# EAGLE design FeetHEizer - Copy (EAGLE 7.1.0)
the FeetHeizer Project Schematics for the main control board. Uses BLE 4.0 module to communicate with a smartphone user interface. It then controls the two MOSFETS to regulate power going to the heating elements in the shoes.
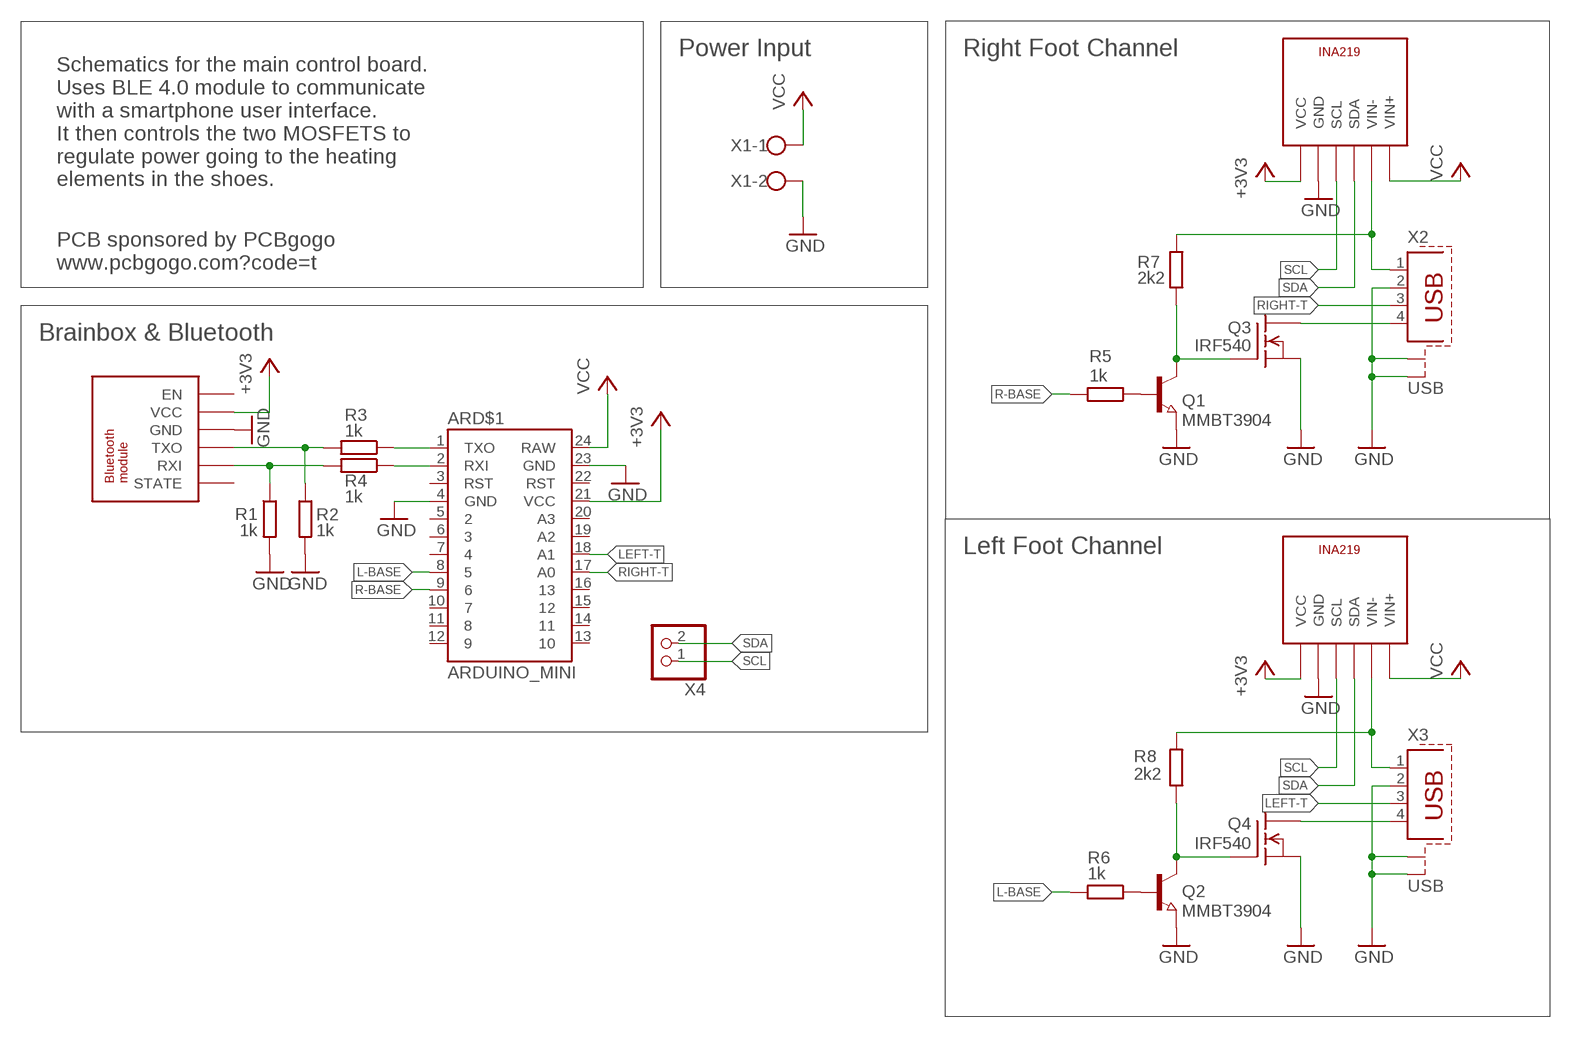
[diagram p0: schematic, sheet 1]

## Parts
ARD$1  ARDUINO_MINI  [ARDUINO_MINI]
MODULE1  BT  [HC10]
MODULE2  INA  [INA]
MODULE3  INA  [INA]
Q1  MMBT3904  NPN-TRANSISTOR_SOT23  [SOT23]
Q2  MMBT3904  NPN-TRANSISTOR_SOT23  [SOT23]
Q3  IRF540  [TO220]
Q4  IRF540  [TO220]
R1  1k  R-EU_R0805  [R0805]
R2  1k  R-EU_R0805  [R0805]
R3  1k  R-EU_R0805  [R0805]
R4  1k  R-EU_R0805  [R0805]
R5  1k  R-EU_R0805  [R0805]
R6  1k  R-EU_R0805  [R0805]
R7  2k2  R-EU_R0805  [R0805]
R8  2k2  R-EU_R0805  [R0805]
X1  W237-102  [W237-102]
X2  USB  [PN87520-S]
X3  USB  [PN87520-S]
X4  PINHD-1X2_2.54  [1X02]

## Nets
+3V3: ARD$1.21(VCC) MODULE1.VCC MODULE2.VCC MODULE3.VCC
GND: ARD$1.4(GND) ARD$1.23(GND) MODULE1.GND MODULE2.GND MODULE3.GND Q1.2(E) Q2.2(E) Q3.3(S) Q4.3(S) R1.2 R2.2 X1.2 X2.2 X2.S1 X2.S2 X3.2 X3.S1 X3.S2
L-BASE: ARD$1.8 R6.2
LEFT-T: ARD$1.18(A1) X3.3
N$1: Q1.3(C) Q3.1(G) R7.1
N$2: Q3.2(D) X2.4
N$3: Q1.1(B) R5.1
N$4: Q2.3(C) Q4.1(G) R8.1
N$5: Q2.1(B) R6.1
N$6: Q4.2(D) X3.4
N$7: MODULE1.RXD(RXI) R1.1 R4.2
N$8: ARD$1.1(TXO) R3.1
N$9: MODULE1.TXD(TXO) R2.1 R3.2
N$10: ARD$1.2(RXI) R4.1
N$11: MODULE2.VIN- R7.2 X2.1
N$12: MODULE3.VIN- R8.2 X3.1
R-BASE: ARD$1.9 R5.2
RIGHT-T: ARD$1.17(A0) X2.3
SCL: MODULE2.SCL MODULE3.SCL X4.1
SDA: MODULE2.SDA MODULE3.SDA X4.2
VCC: ARD$1.24(RAW) MODULE2.VIN+ MODULE3.VIN+ X1.1
Unconnected: ARD$1.3(RST) ARD$1.5 ARD$1.6 ARD$1.7 ARD$1.10 ARD$1.11 ARD$1.12 ARD$1.13 ARD$1.14 ARD$1.15 ARD$1.16 ARD$1.19(A2) ARD$1.20(A3) ARD$1.22(RST) MODULE1.EN MODULE1.STATE

## Notes on the sheet
- Schematics for the main control board.
  Uses BLE 4.0 module to communicate
  with a smartphone user interface.
  It then controls the two MOSFETS to
  regulate power going to the heating
  elements in the shoes.
- Power Input | Right Foot Channel
- PCB sponsored by PCBgogo
  www.pcbgogo.com?code=t
- Brainbox & Bluetooth
- Left Foot Channel

## Library data of the parts
ARD$1 = SparkFun-Boards:ARDUINO_MINI: Arduino Pro Mini footprint
MODULE1 = EEPsModules:BT: HM-10 BLE 4.0 Bluetooth Low Energy Module
MODULE2 MODULE3 = EEPsModules:INA: INA219 Current sensor
Q1 Q2 = semicon-smd-ipc:NPN-TRANSISTOR_: NPN TRANSISTOR
Q3 Q4 = transistor-fet:IRF540: N-Channel Enhancement MOSFET (HEXFET); 100V; 28A; 0,077Ohm
R1-R8 = rcl:R-EU_: RESISTOR, European symbol
X1 = con-wago-500:W237-102: WAGO SCREW CLAMP; MPN: 237-102; OC_FARNELL: unknown; OC_NEWARK: 70K9898
X2 X3 = con-berg-modified:USB
X4 = pinhead-1:PINHD-1X2: PIN HEADER

## Board
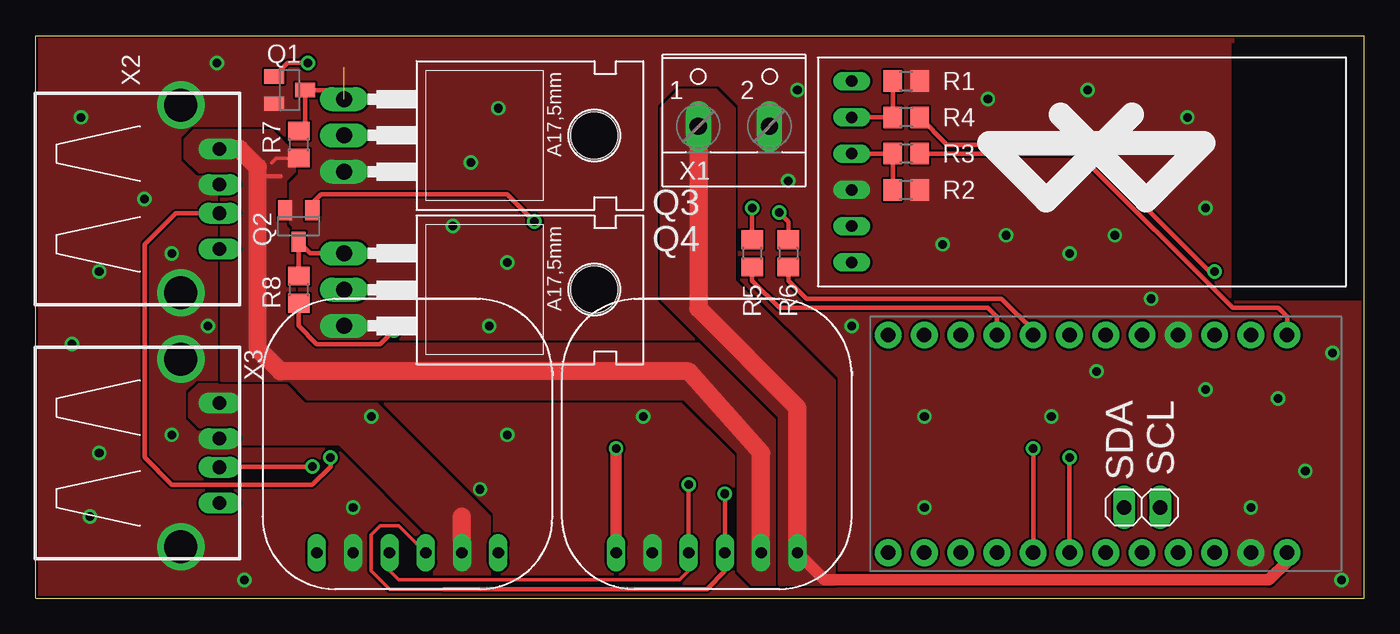
[diagram p1: board, top side]
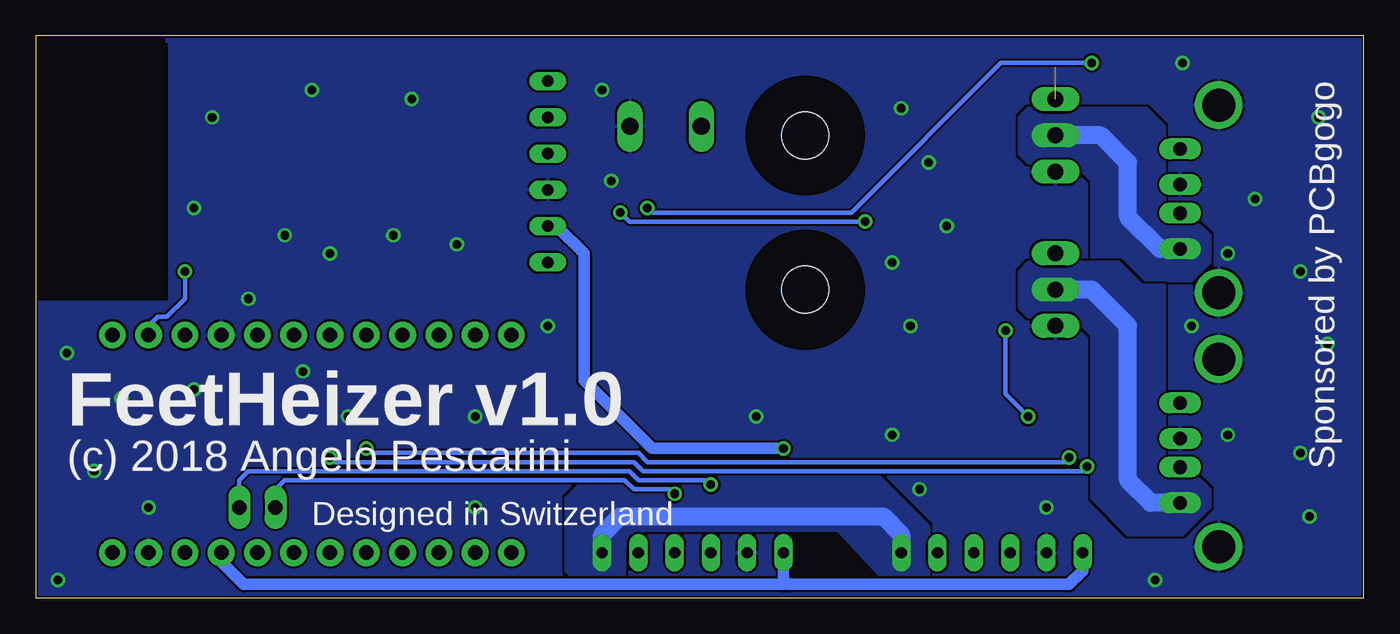
[diagram p2: board, bottom side, seen from below]

Size 93 x 39.37 mm. Coordinates in mm from the lower left corner, seen from the top.
Outline: 0,0 93,0 93,39.37 0,39.37 0,0
Copper layers (1*16): Top 0.035mm / dielectric 1.5mm / Bottom 0.035mm
Design rules "pcbgogo *": minimum track width 6mil, minimum drill 24mil, track to track 6mil, track to pad 6mil, pad to pad 6mil, via to via 6mil, smd to smd 6mil, copper to edge 6mil, drill to drill 0mil, minimum pad ring 10mil, minimum via ring 8mil, stop-mask expansion 4mil, vias tented up to drill 25mil, thermal gap 6mil

### Footprints (pad centres in the part's own frame; a part is rotated, then mirrored left to right if it is on the bottom)
ARDUINO_MINI = drill 1.016 pad 1.88: 1 -7.62,12.7; 2 -7.62,10.16; 3 -7.62,7.62; 4 -7.62,5.08; 5 -7.62,2.54; 6 -7.62,0; 7 -7.62,-2.54; 8 -7.62,-5.08; 9 -7.62,-7.62; 10 -7.62,-10.16; 11 -7.62,-12.7; 12 -7.62,-15.24; 13 7.62,-15.24; 14 7.62,-12.7; 15 7.62,-10.16; 16 7.62,-7.62; 17 7.62,-5.08; 18 7.62,-2.54; 19 7.62,0; 20 7.62,2.54; 21 7.62,5.08; 22 7.62,7.62; 23 7.62,10.16; 24 7.62,12.7
HC10 = drill 0.8 long: EN 6.35,-7.62; GND 1.27,-7.62; RXD -3.81,-7.62; STATE -6.35,-7.62; TXD -1.27,-7.62; VCC 3.81,-7.62
INA = drill 0.8 long: GND -3.81,-6.35; SCL -1.27,-6.35; SDA 1.27,-6.35; VCC -6.35,-6.35; VIN+ 6.35,-6.35; VIN- 3.81,-6.35
SOT23 = smd 1 x 1.4: 1 -0.95,-1.1; 2 0.95,-1.1; 3 0,1.1
TO220 = drill 1.118 long: 1 -2.54,-6.35; 2 0,-6.35; 3 2.54,-6.35 | hole 3.302: 0,11.176
R0805 = smd 1.3 x 1.5: 1 -0.95,0; 2 0.95,0
W237-102 = drill 1.194 long: 1 -2.5,-1.27; 2 2.5,-1.27
PN87520-S = drill 0.95 long: 1 -3.5,2.71; 2 -1,2.71; 3 1,2.71; 4 3.5,2.71 | drill 2.3 pad 2.9: S1 -6.57,0; S2 6.57,0
1X02 = drill 1.016 long: 1 -1.27,0; 2 1.27,0

### Placement (x,y rotation side)
ARD$1  74.93,10.79 270 top
MODULE1  64.77,29.84 270 top
MODULE2  46.99,9.53 0 top
MODULE3  26.04,9.53 0 top
Q1  17.78,35.56 270 top
Q2  18.41,26.04 180 top
Q3  27.94,32.39 270 top
Q4  27.94,21.59 270 top
R1  60.96,36.2 0 top
R2  60.96,28.57 0 top
R3  60.96,31.11 180 top
R4  60.96,33.66 180 top
R5  50.16,24.13 270 top
R6  52.7,24.13 270 top
R7  18.41,31.75 270 top
R8  18.41,21.59 270 top
X1  48.9,34.29 0 top
X2  10.16,27.94 270 top
X3  10.16,10.16 270 top
X4  77.47,6.35 180 top

### Tracks (layer width: path | path; a pad name or v marks a point on that pad's centre or on a via)
+3V3  (via drill 0.6)
  Top 0.813: v40.64,10.48 MODULE2.VCC
  Bottom 0.813: MODULE2.VCC 40.64,1.27 | 40.64,1.27 40.64,0.95 78.42,0.95 80.01,2.54 ARD$1.21 | MODULE3.VCC 19.68,1.91 20.64,0.95 40.32,0.95 40.64,1.27 | v40.64,10.48 49.85,10.48 54.61,15.24 54.61,24.13 56.52,26.04 MODULE1.VCC
GND  (via drill 0.6)
  other vias: 63.5,24.76 73.66,35.56 72.39,24.13 78.11,20.95 87,13.97 85.09,6.35 81.92,14.61 71.12,12.7 74.3,15.88 62.23,12.7 62.23,6.35 88.9,8.89 91.44,1.27 42.55,12.7 33.02,11.43 22.23,6.35 31.11,7.62 14.61,1.27 3.81,5.71 4.45,10.16 2.54,17.78 4.45,22.86 7.62,27.94 3.17,33.66 12.7,37.47 9.53,11.43 12.06,19.05 9.53,24.13 31.75,19.05 33.02,23.49 29.21,26.04 32.38,34.29 30.48,30.48 53.34,35.56 52.7,29.21 80.64,33.66 67.94,25.4 66.67,34.93 75.56,25.4 81.92,27.3 90.81,17.14 57.15,19.05
  pour Top (rank 6, no thermals): 0,39.37 83.82,39.37 83.82,20.95 93.34,20.95 93.34,0 0,0
  pour Bottom (rank 6): 0,39.37 83.82,39.37 83.82,20.95 93.34,20.95 93.34,0 0,0
L-BASE
  Top 0.305: ARD$1.8 69.85,18.73 67.63,20.95 53.98,20.95 52.7,22.22 R6.2
LEFT-T  (via drill 0.6)
  Top 0.305: v72.39,9.84 ARD$1.18 | v19.37,9.21 12.92,9.21 X3.3
  Bottom 0.305: v72.39,9.84 72.07,9.53 51.12,9.53 50.48,8.89 19.68,8.89 v19.37,9.21
N$1  (1 unrouted)
  Top 0.305: Q3.1 20.95,35.56 Q1.3 18.88,33.16 R7.1
N$2
  Bottom 1.27: X2.4 14.28,24.44 16.51,26.67 16.51,30.48 18.41,32.39 Q3.2
  pour Bottom (rank 2, no thermals): 12.06,22.22 15.24,22.22 16.83,23.81 19.05,23.81 19.05,29.21 20.32,30.48 23.5,30.48 24.13,31.11 24.13,33.66 23.5,34.29 15.24,34.29 13.97,33.02 13.97,27.3 13.34,26.67 12.06,26.67 10.79,25.4 10.79,23.49
N$3  (via drill 0.6)
  Top 0.305: R5.1 v50.16,27.3 | v19.05,37.47 17.64,37.47 Q1.1
  Bottom 0.305: v19.05,37.47 25.4,37.47 35.88,26.99 49.85,26.99 v50.16,27.3
N$4
  Top 0.305: R8.1 Q2.3 19.22,24.13 Q4.1 21.27,24.44
N$5  (via drill 0.6)
  Top 0.305: Q2.1 19.37,27.62 20,28.26 33.02,28.26 v34.92,26.35 | R6.1 52.7,26.35 v52.07,26.99
  Bottom 0.305: v52.07,26.99 51.44,26.35 v34.92,26.35
N$6
  Bottom 1.27: X3.4 14.91,6.66 16.51,8.26 16.51,19.05 19.05,21.59 Q4.2
  pour Bottom (no thermals): 12.7,4.45 16.51,4.45 19.05,6.99 19.05,18.41 20.32,19.68 23.5,19.68 24.13,20.32 24.13,22.86 23.5,23.49 17.14,23.49 15.56,21.91 13.97,21.91 13.97,20.32 13.97,9.53 13.34,8.89 12.06,8.89 10.79,7.62 10.79,6.35
N$7
  Top 0.305: MODULE1.RXD R4.2 R1.1
N$8
  Top 0.305: ARD$1.1 87.63,19.68 87,20.32 83.82,20.32 73.03,31.11 R3.1
N$9
  Top 0.305: MODULE1.TXD R3.2 R2.1
N$10  (via drill 0.6)
  Top 0.305: v82.55,22.86 82.23,22.86 73.34,31.75 63.81,31.75 R4.1
  Bottom 0.305: ARD$1.2 85.09,19.05 84.45,19.68 83.82,19.68 82.55,20.95 v82.55,22.86
N$11
  Top 0.254: R7.2 16.83,30.8 16.51,30.48
  Top 0.305: 17.14,29.53 15.56,29.53
  Top 1.27: MODULE2.VIN- 50.8,10.16 45.72,15.88 17.14,15.88 15.56,17.46 15.56,29.53 15.56,30.16 14.29,31.43 12.88,31.43 X2.1
  pour Top (rank 2, no thermals): 52.7,0.95 50.16,0.95 49.21,1.91 49.21,10.16 45.4,13.97 19.05,13.97 17.78,15.24 13.02,15.24 13.02,29.53 12.7,29.84 11.43,29.84 10.48,30.8 10.48,32.07 11.11,32.7 16.51,32.7 18.1,31.11 18.1,29.84 17.46,29.21 17.46,26.04 18.1,25.4 18.1,19.05 19.37,17.78 47.31,17.78 52.7,12.38
N$12  (via drill 0.6)
  Top 0.305: R8.2 18.41,19.05 19.68,17.78 24.13,17.78 v25.08,18.73
  Top 1.27: MODULE3.VIN- 29.84,5.71
  Bottom 0.305: v25.08,18.73 25.08,14.29 v23.5,12.7
  pour Top (rank 3, no thermals): 27.94,1.27 31.75,1.27 31.75,5.71 22.54,14.92 11.43,14.92 10.79,14.29 10.79,12.7 12.7,10.79 21.27,10.79 27.94,4.13
R-BASE
  Top 0.305: ARD$1.9 67.31,19.68 66.67,20.32 52.07,20.32 50.16,22.22 R5.2
RIGHT-T  (via drill 0.6)
  Top 0.305: X2.3 9.79,26.94 7.62,24.76 7.62,9.84 9.53,7.94 19.37,7.94 20.64,9.21 v20.64,9.84 | v69.85,10.48 ARD$1.17
  Bottom 0.305: v69.85,10.48 69.53,10.16 50.8,10.16 50.16,9.53 20.95,9.53 v20.64,9.84
SCL  (via drill 0.6)
  Top 0.254: MODULE2.SCL 45.72,1.91 45.09,1.27 25.4,1.27 24.77,1.91 MODULE3.SCL
  Top 0.305: MODULE2.SCL v45.72,7.94
  Bottom 0.305: X4.1 78.74,8.26 78.11,8.89 51.44,8.89 50.8,8.26 46.04,8.26 v45.72,7.94
SDA  (via drill 0.6)
  Top 0.254: 28.57,0.64 24.77,0.64 23.5,1.91 23.5,4.45 24.13,5.08 25.4,5.08 MODULE3.SDA
  Top 0.305: 28.57,0.64 46.99,0.64 48.26,1.91 MODULE2.SDA v48.26,7.3
  Bottom 0.305: X4.2 76.2,7.62 75.56,8.26 51.75,8.26 51.12,7.62 48.58,7.62 v48.26,7.3
VCC
  Top 0.813: ARD$1.24 87.63,2.54 86.36,1.27 55.24,1.27 MODULE2.VIN+
  Top 1.27: X1.1 46.4,20.28 53.34,13.34 MODULE2.VIN+
  Bottom 1.27: MODULE2.VIN+ 53.34,4.45 52.07,5.71 33.66,5.71 32.38,4.45 MODULE3.VIN+
  pour Top (no thermals): 45.09,35.56 47.62,35.56 48.9,34.29 48.9,22.22 55.88,15.24 55.88,0.95 52.07,0.95 52.07,12.7 43.81,20.95 43.81,34.29
  pour Bottom (no thermals): 51.75,1.27 55.24,1.27 55.88,1.91 55.88,6.99 53.98,8.89 34.29,8.89 30.48,5.08 30.48,0.95 33.34,0.95 36.83,4.76 50.48,4.76 51.75,3.49

### Text on the board
tNames: SDA | SCL
bNames: Sponsored by PCBgogo | FeetHeizer v1.0 | (c) 2018 Angelo Pescarini | Designed in Switzerland